# EAGLE schematic finalboardsch (EAGLE 8.7.0)
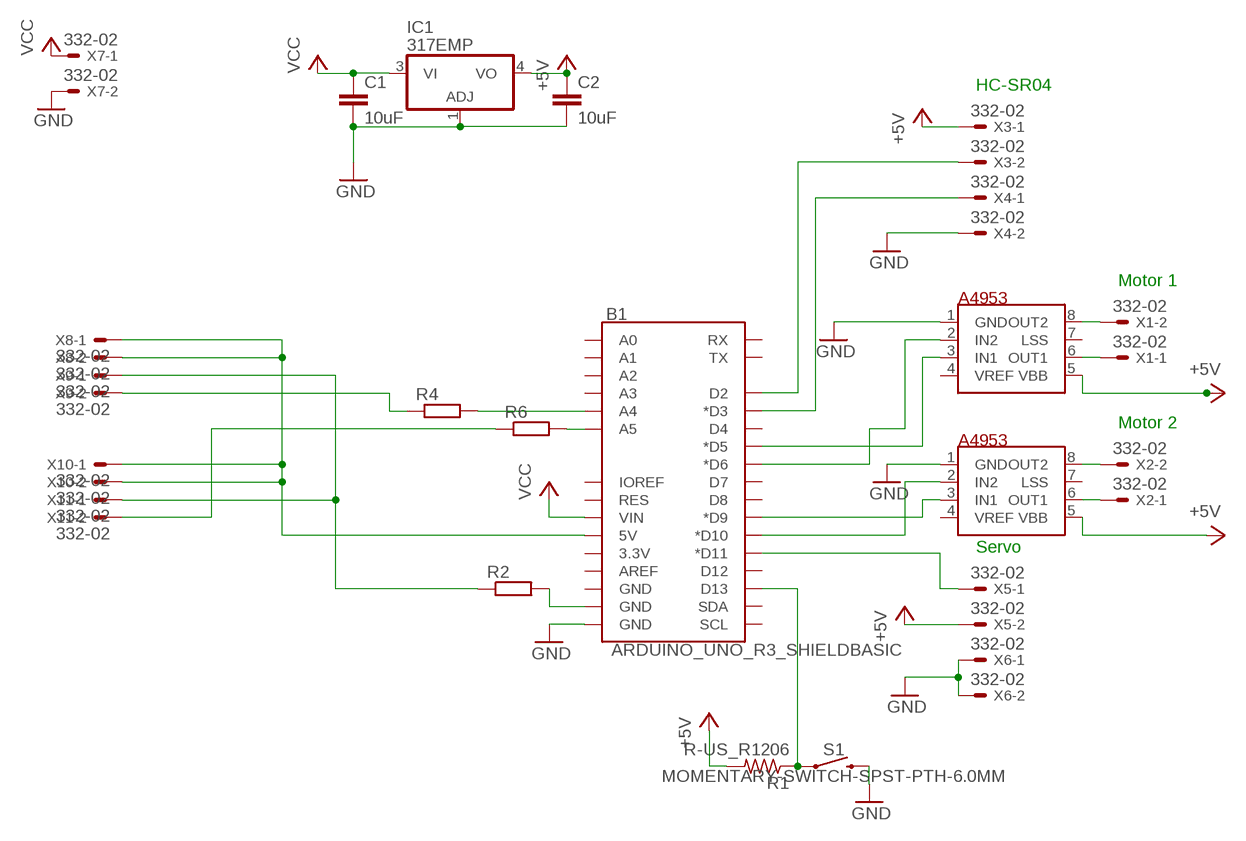
[diagram p0: schematic, sheet 1]

## Parts
A1  A4953  [SO08]
A2  A4953  [SO08]
B1  ARDUINO_UNO_R3_SHIELDBASIC  [UNO_R3_SHIELD]
C1  10uF  10UF-1206-6.3V-20%  [1206]
C2  10uF  10UF-1206-6.3V-20%  [1206]
IC1  317EMP  [SOT223]
R1  R-US_R1206  [R1206]
R2  RR1206  [R1206]
R4  RR1206  [R1206]
R6  RR1206  [R1206]
S1  MOMENTARY-SWITCH-SPST-PTH-6.0MM  [TACTILE_SWITCH_PTH_6.0MM]
X1  332-02  [332-02]
X2  332-02  [332-02]
X3  332-02  [332-02]
X4  332-02  [332-02]
X5  332-02  [332-02]
X6  332-02  [332-02]
X7  332-02  [332-02]
X8  332-02  [332-02]
X9  332-02  [332-02]
X10  332-02  [332-02]
X11  332-02  [332-02]

## Nets
+5V: A1.5(VBB) A2.5(VBB) C2.1 IC1.4(VO) R1.2 X3.1 X5.2
GND: A1.1(GND) A2.1(GND) B1.GND@0(GND) C1.2 C2.2 IC1.1(ADJ) S1.3 X4.2 X6.1 X6.2 X7.2
N$1: A1.3(IN1) B1.D5(*D5)
N$2: A1.2(IN2) B1.D6(*D6)
N$3: A2.3(IN1) B1.D9(*D9)
N$4: A2.2(IN2) B1.D10(*D10)
N$5: A1.6(OUT1) X1.1
N$6: A1.8(OUT2) X1.2
N$7: A2.6(OUT1) X2.1
N$8: A2.8(OUT2) X2.2
N$9: B1.D3(*D3) X4.1
N$11: B1.D11(*D11) X5.1
N$12: B1.D13 R1.1 S1.1
N$13: B1.A4 R4.2
N$15: R2.1 X9.1 X11.1
N$16: B1.GND@1(GND) R2.2
N$17: R4.1 X9.2
N$18: B1.5V X8.1 X8.2 X10.1 X10.2
N$19: B1.A5 R6.2
N$20: R6.1 X11.2
N$21: B1.D2 X3.2
VCC: B1.VIN C1.1 IC1.3(VI) X7.1
Unconnected: A1.4(VREF) A1.7(LSS) A2.4(VREF) A2.7(LSS) B1.3.3V B1.A0 B1.A1 B1.A2 B1.A3 B1.AREF B1.D4 B1.D7 B1.D8 B1.D12 B1.GND@2(GND) B1.IOREF B1.RES B1.RX B1.SCL B1.SDA B1.TX

## Notes on the sheet
- HC-SR04
- Motor 1
- Motor 2
- Servo

## Library data of the parts
A1 A2 = SparkFun-IC-Power:A4953: A4953 Full-Bridge DMOS PWM Motor Drivers
B1 = SparkFun-Boards:ARDUINO_UNO_R3_SHIELD: Arduino R3 Shield Footprint Shield form compatible with the Arduino Uno R3. SparkFun Products: MG2639 Cellular Shield <https://www.sparkfun.com/products/13120> MIDI Shield <https://www.sparkfun.com/products/12898> R3 Stackable Headers Kit <https://www.sparkfun.com/products/11417>
C1 C2 = SparkFun-Capacitors:10UF: 10.0µF ceramic capacitors A capacitor is a passive two-terminal electrical component used to store electrical energy temporarily in an electric field.; PROD_ID: CAP-10057
IC1 = linear:*317: Positive VOLTAGE REGULATOR
R1 = audio amplifier example:R-US_: RESISTOR, American symbol
R2 R4 R6 = eagle-ltspice:R: RESISTOR, European symbol; SPICEMODEL: NONE; SPICEPREFIX: R
S1 = SparkFun-Switches:MOMENTARY-SWITCH-SPST: Momentary Switch (Pushbutton) - SPST Normally-open (NO) SPST momentary switches (buttons, pushbuttons). Variants PTH-12MM - 12mm square, through-hole Momentary Pushbutton Switch - 12mm Square <https://www.sparkfun.com/products/9190> (COM-09190) PTH-6.0MM, PTH-6.0MM-KIT - 6.0mm square, through-hole Mini Pushbutton Switch <https://www.sparkfun.com/products/97> (COM-00097) KIT package intended for soldering kit's - only one side of pads' copper is exposed. PTH-RIGHT-ANGLE-KIT - Right-angle, through-hole Right Angle Tactile Button <https://www.sparkfun.com/products/10791> - Used on SparkFun BigTime Watch Kit <https://www.sparkfun.com/products/11734> SMD-12MM - 12mm square, surface-mount Tactile Button - SMD (12mm) <https://www.sparkfun.com/products/12993> (COM-12993) Used on SparkFun PicoBoard <https://www.sparkfun.com/products/11888> SMD-4.5MM - 4.5mm Square Trackball Switch Used on SparkFun Blackberry Trackballer Breakout <https://www.sparkfun.com/products/13169> SMD-4.6MMX2.8MM - 4.60mm x 2.80mm, surface mount Used on SparkFun SAMD21 Mini Breakout <https://www.sparkfun.com/products/13664> SMD-5.2MM, SMD-5.2-REDUNDANT - 5.2mm square, surface-mount Mini Pushbutton Switch - SMD <https://www.sparkfun.com/products/8720> (COM-08720) Used on Arduino Pro Mini <https://www.sparkfun.com/products/11114> REDUNDANT package connects both switch circuits together SMD-6.0X3.5MM - 6.0 x 3.5mm, surface mount Momentary Reset Switch SMD <https://www.sparkfun.com/products/8229> (COM-08229) SMD-6.2MM-TALL - 6.2mm square, surface mount Tactile Button - SMD (6mm) <https://www.sparkfun.com/products/12992> Used on SparkFun Digital Sandbox <https://www.sparkfun.com/products/12651> SMD-RIGHT-ANGLE - Right-angle, surface mount Used on SparkFun Block for Intel® Edison - Arduino <https://www.sparkfun.com/products/13036>; PROD_ID: SWCH-08441; SF_SKU: COM-00097
X1-X11 = con-garry:332-02: 2 Pin - 2mm Dual Row Source: www.mpe-connector.de / garry_shortform_2012.pdf